# EAGLE design 1.2 (EAGLE 7.7.0)
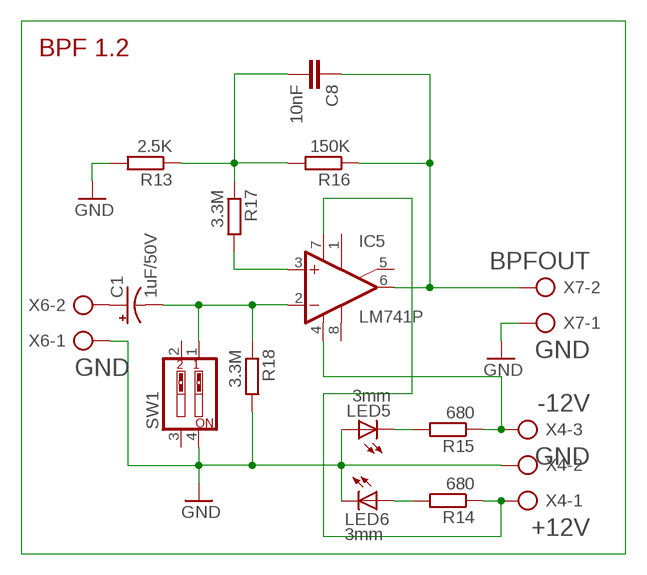
[diagram p0: schematic, sheet 1]

## Parts
C1  1uF/50V  CPOL-USE2,5-6E  [E2,5-6E]
C8  10nF  C-EU050-025X075  [C050-025X075]
IC5  LM741P  [DIL08]
LED5  3mm  LED5MM  [LED5MM]
LED6  3mm  LED5MM  [LED5MM]
R13  2.5K  R-EU_0207/10  [0207/10]
R14  680  R-EU_0207/10  [0207/10]
R15  680  R-EU_0207/10  [0207/10]
R16  150K  R-EU_0207/10  [0207/10]
R17  3.3M  R-EU_0207/10  [0207/10]
R18  3.3M  R-EU_0207/10  [0207/10]
SW1  SW_DIP-2  [EDG-02]
X4  AK500/3-H  [AK500/3-H]
X6  AK500/2-H  [AK500/2-H]
X7  AK500/2-H  [AK500/2-H]

## Nets
+12V: IC5.7(V+) R14.1 X4.1
-12V: IC5.4(V-) R15.1 X4.3
BPFOUT: C8.1 IC5.6(OUT) R16.1 X7.2
GND: LED5.A LED6.K(C) R13.2 R18.2 SW1.4 X4.2 X6.1 X7.1
N$1: C1.+ X6.2
N$9: IC5.3(+IN) R17.2
N$10: C8.2 R13.1 R16.2 R17.1
N$16: C1.- IC5.2(-IN) R18.1 SW1.1
N$23: LED5.K(C) R15.2
N$25: LED6.A R14.2
Unconnected: IC5.1(ON1) IC5.5(ON2) IC5.8(OPT) SW1.2 SW1.3

## Notes on the sheet
- BPF 1.2

## Library data of the parts
C1 = rcl:CPOL-US: POLARIZED CAPACITOR, American symbol
C8 = rcl:C-EU: CAPACITOR, European symbol
IC5 = linear:*741: OP AMP
LED5 LED6 = led:LED: LED OSRAM: - CHIPLED LG R971, LG N971, LY N971, LG Q971, LY Q971, LO R971, LY R971 LH N974, LH R974 LS Q976, LO Q976, LY Q976 LO Q996 - Hyper CHIPLED LW Q18S LB Q993, LB Q99A, LB R99A - SideLED LS A670, LO A670, LY A670, LG A670, LP A670 LB A673, LV A673, LT A673, LW A673 LH A674 LY A675 LS A676, LA A676, LO A676, LY A676, LW A676 LS A679, LY A679, LG A679 - Hyper Micro SIDELED® LS Y876, LA Y876, LO Y876, LY Y876 LT Y87S - SmartLED LW L88C, LW L88S LB L89C, LB L89S, LG L890 LS L89K, LO L89K, LY L89K LS L896, LA L896, LO L896, LY L896 - TOPLED LS T670, LO T670, LY T670, LG T670, LP T670 LSG T670, LSP T670, LSY T670, LOP T670, LYG T670 LG T671, LOG T671, LSG T671 LB T673, LV T673, LT T673, LW T673 LH T674 LS T676, LA T676, LO T676, LY T676, LB T676, LH T676, LSB T676, LW T676 LB T67C, LV T67C, LT T67C, LS T67K, LO T67K, LY T67K, LW E67C LS E67B, LA E67B, LO E67B, LY E67B, LB E67C, LV E67C, LT E67C LW T67C LS T679, LY T679, LG T679 LS T770, LO T770, LY T770, LG T770, LP T770 LB T773, LV T773, LT T773, LW T773 LH T774 LS E675, LA E675, LY E675, LS T675 LS T776, LA T776, LO T776, LY T776, LB T776 LHGB T686 LT T68C, LB T68C - Hyper Mini TOPLED® LB M676 - Mini TOPLED Santana® LG M470 LS M47K, LO M47K, LY M47K Source: http://www.osram.convergy.de LUXEON: - LUMILED® LXK2-PW12-R00, LXK2-PW12-S00, LXK2-PW14-U00, LXK2-PW14-V00 LXK2-PM12-R00, LXK2-PM12-S00, LXK2-PM14-U00 LXK2-PE12-Q00, LXK2-PE12-R00, LXK2-PE12-S00, LXK2-PE14-T00, LXK2-PE14-U00 LXK2-PB12-K00, LXK2-PB12-L00, LXK2-PB12-M00, LXK2-PB14-N00, LXK2-PB14-P00, LXK2-PB14-Q00 LXK2-PR12-L00, LXK2-PR12-M00, LXK2-PR14-Q00, LXK2-PR14-R00 LXK2-PD12-Q00, LXK2-PD12-R00, LXK2-PD12-S00 LXK2-PH12-R00, LXK2-PH12-S00 LXK2-PL12-P00, LXK2-PL12-Q00, LXK2-PL12-R00 Source: www.luxeon.com KINGBRIGHT: KA-3528ASYC Source: www.kingbright.com
R13-R18 = resistor:R-EU_: RESISTOR, European symbol
SW1 = special:SW_DIP-2: DIP SWITCH
X4 = con-ptr500:AK500/3-H: CONNECTOR Aug. 2004 / PTR Meßtechnik: Die Bezeichnung der Serie AK505 wurde geändert. Es handelt sich hierbei um AK500 in horizontaler Ausführung.; OC_FARNELL: unknown; OC_NEWARK: unknown
X6 X7 = con-ptr500:AK500/2-H: CONNECTOR Aug. 2004 / PTR Meßtechnik: Die Bezeichnung der Serie AK505 wurde geändert. Es handelt sich hierbei um AK500 in horizontaler Ausführung.; OC_FARNELL: unknown; OC_NEWARK: unknown

## Board
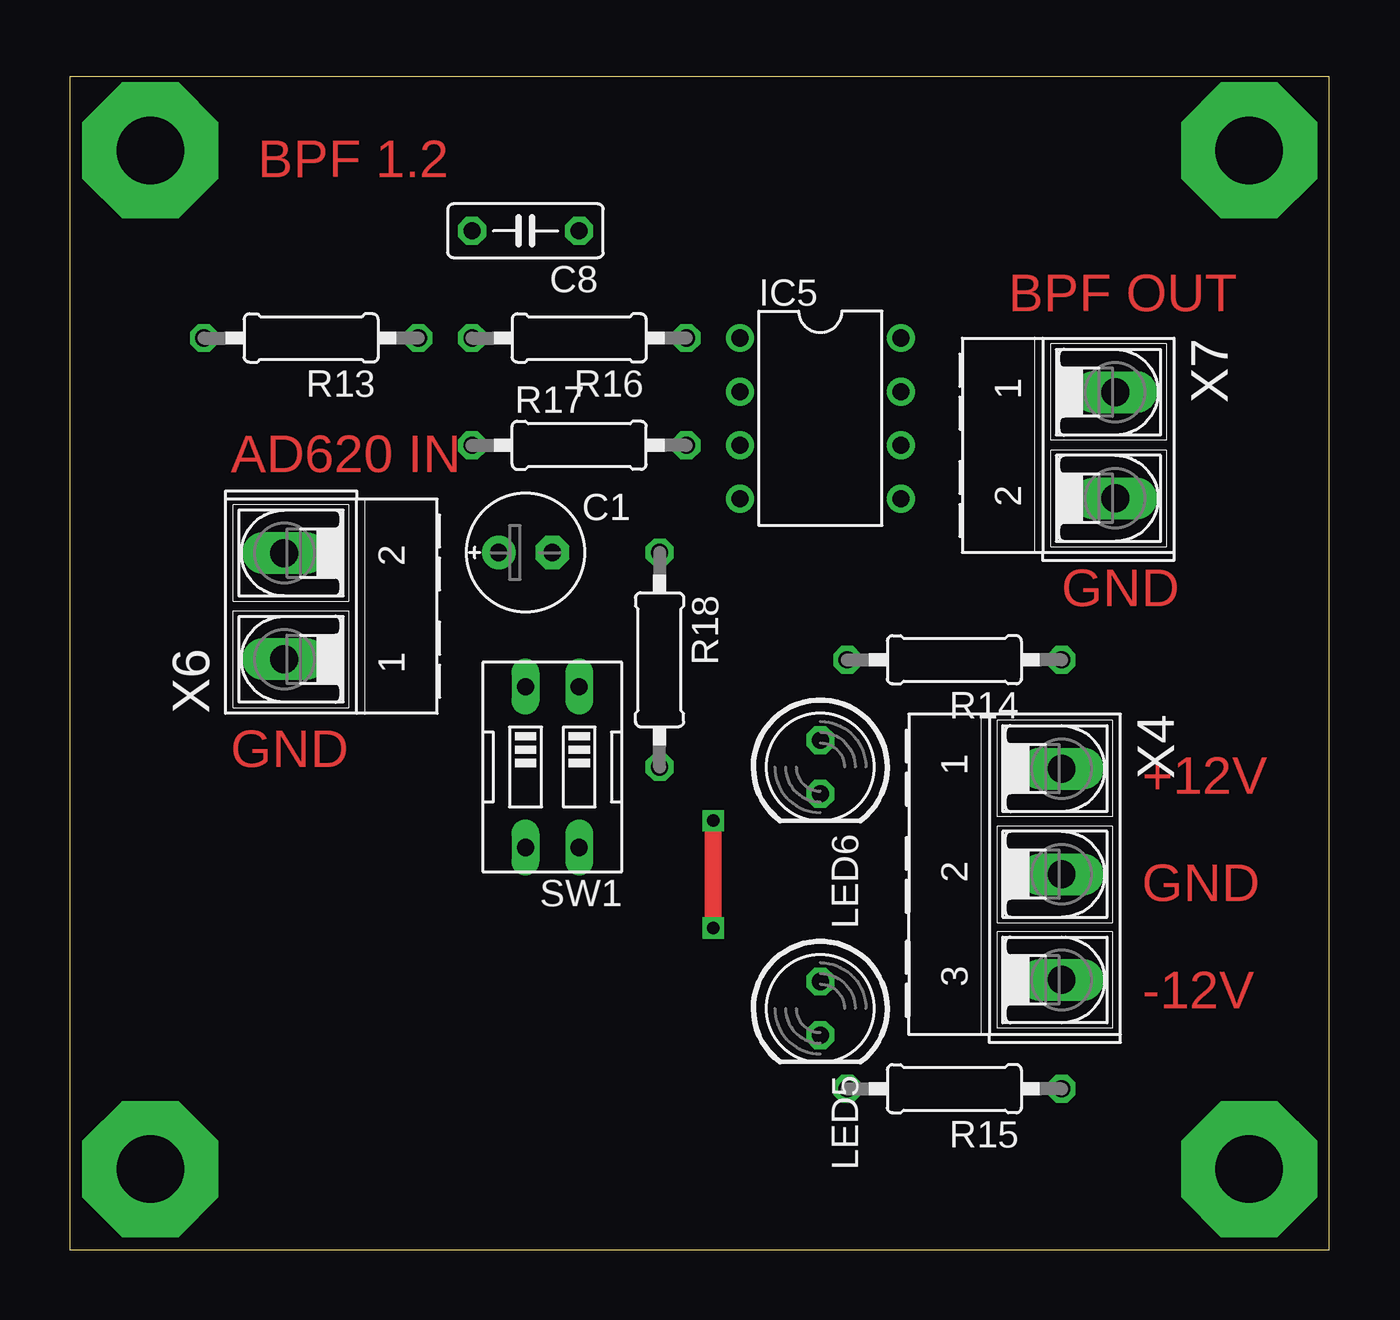
[diagram p1: board, top side]
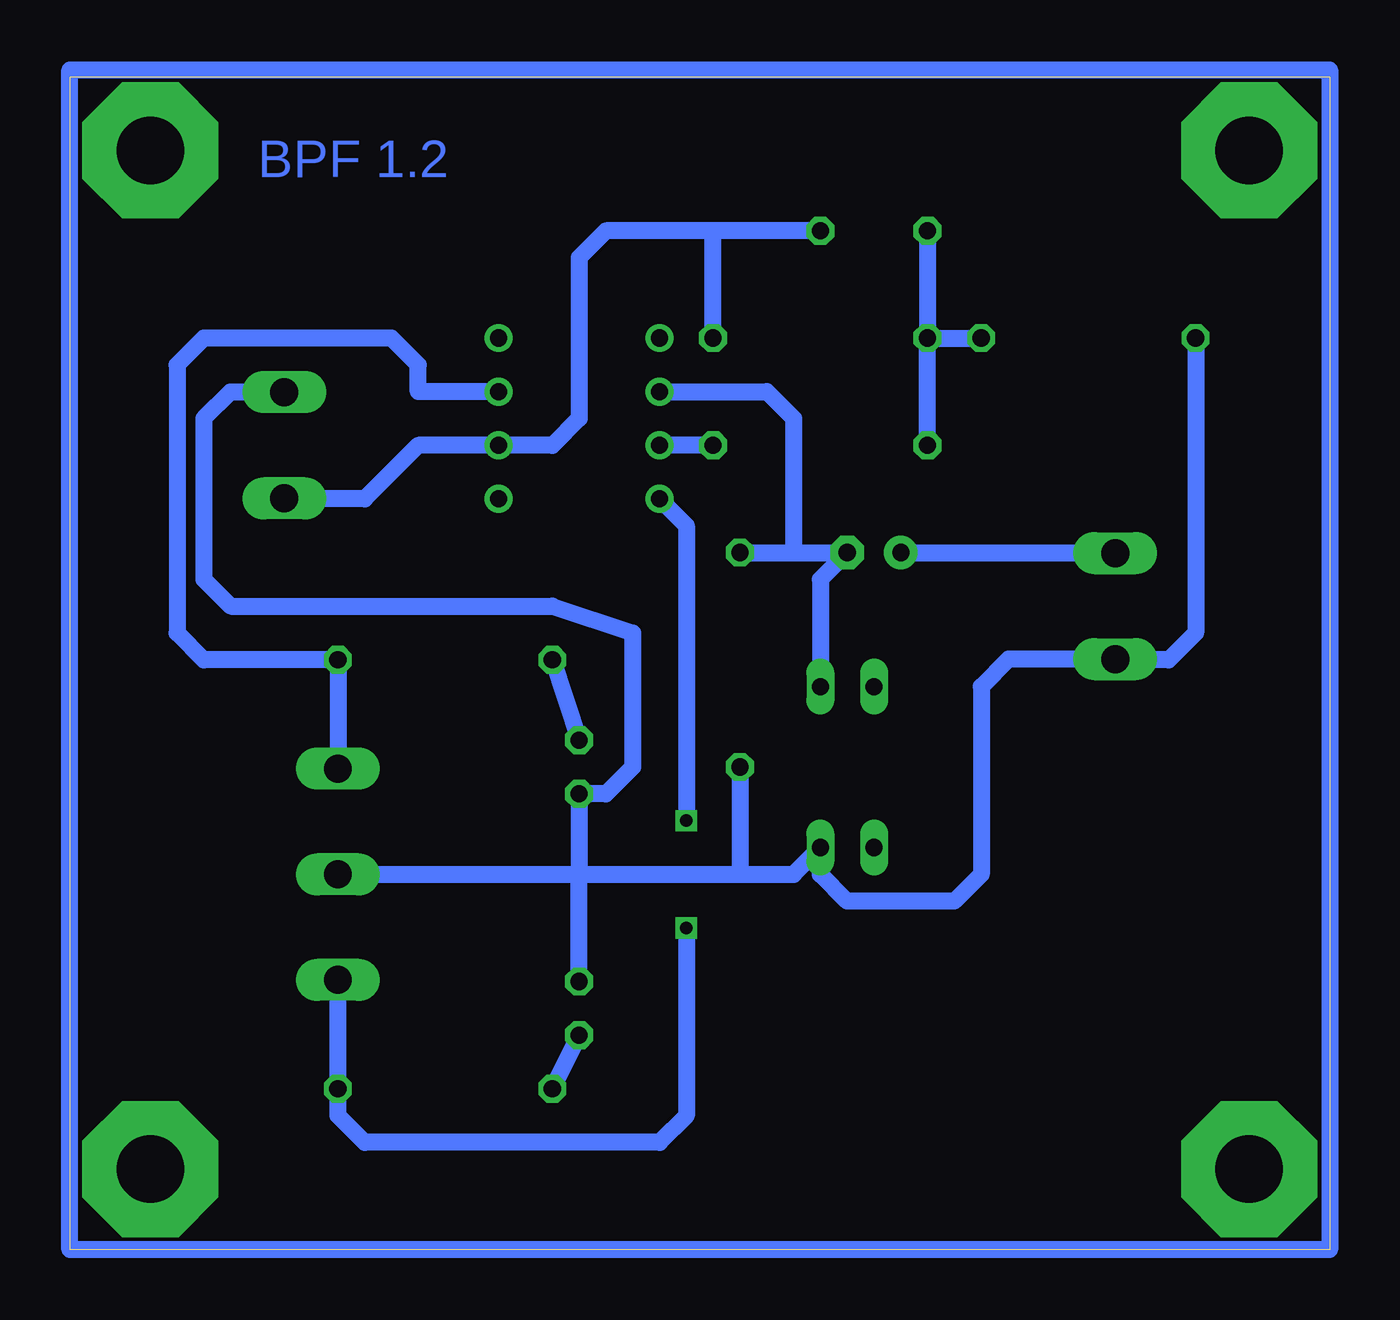
[diagram p2: board, bottom side, seen from below]

Size 59.67 x 55.55 mm. Coordinates in mm from the lower left corner, seen from the top.
Outline: 0,0 59.67,0 59.67,55.55 0,55.55 0,0
Copper layers (1*16): Top 0.035mm / dielectric 1.5mm / Bottom 0.035mm
Design rules "default": minimum track width 10mil, minimum drill 24mil, track to track 8mil, track to pad 8mil, pad to pad 8mil, via to via 8mil, smd to smd 8mil, copper to edge 40mil, drill to drill 8mil, minimum pad ring 10mil, minimum via ring 8mil, stop-mask expansion 4mil, vias tented up to drill 0mil, thermal gap 10mil

### Footprints (pad centres in the part's own frame; a part is rotated, then mirrored left to right if it is on the bottom)
E2,5-6E = drill 0.813 pad 1.575: + -1.27,0 | drill 0.813 pad 1.575 octagon: - 1.27,0
C050-025X075 = drill 0.813 octagon: 1 -2.54,0; 2 2.54,0
DIL08 = drill 0.813 pad 1.27: 1 -3.81,-3.81; 2 -1.27,-3.81; 3 1.27,-3.81; 4 3.81,-3.81; 5 3.81,3.81; 6 1.27,3.81; 7 -1.27,3.81; 8 -3.81,3.81
LED5MM = drill 0.813 octagon: A -1.27,0; K 1.27,0
0207/10 = drill 0.813 octagon: 1 -5.08,0; 2 5.08,0
EDG-02 = drill 0.813 long: 1 -1.27,-3.81; 2 1.27,-3.81; 3 1.27,3.81; 4 -1.27,3.81
AK500/3-H = drill 1.321 long: 1 -5.004,0; 2 0,0; 3 5.004,0
AK500/2-H = drill 1.321 long: 1 -2.515,0; 2 2.515,0

### Placement (x,y rotation side)
C1  21.59,33.02 0 top
C8  21.59,48.26 180 top
IC5  35.56,39.37 270 top
LED5  35.56,11.43 270 top
LED6  35.56,22.86 270 top
R13  11.43,43.18 180 top
R14  41.91,27.94 180 top
R15  41.91,7.62 180 top
R16  24.13,43.18 180 top
R17  24.13,38.1 0 top
R18  27.94,27.94 270 top
SW1  22.86,22.86 180 top
X4  46.99,17.78 270 top
X6  10.16,30.48 90 top
X7  49.53,38.1 270 top

### Tracks (layer width: path | path; a pad name or v marks a point on that pad's centre or on a via)
+12V
  Bottom 0.813: X4.1 R14.1 53.34,27.94 54.61,29.21 54.61,41.91 53.34,43.18 44.45,43.18 43.18,41.91 43.18,40.64 IC5.7
-12V  (via drill 0.6 pad 0.81)
  Top 0.813: v30.48,20.32 v30.48,15.24
  Bottom 0.813: X4.3 R15.1 46.99,6.35 45.72,5.08 31.75,5.08 30.48,6.35 v30.48,15.24 | IC5.4 30.48,34.29 v30.48,20.32
BPFOUT
  Bottom 0.813: C8.1 29.21,48.26 | 29.21,48.26 34.29,48.26 35.56,46.99 35.56,39.37 36.83,38.1 IC5.6 43.18,38.1 45.72,35.56 49.51,35.56 X7.2 | R16.1 29.21,48.26
GND
  Bottom 0.813: X4.2 35.56,17.78 | 35.56,17.78 27.94,17.78 | 27.94,17.78 25.4,17.78 SW1.4 24.13,17.78 22.86,16.51 17.78,16.51 16.51,17.78 16.51,26.67 15.21,27.96 X6.1 10.13,27.94 7.62,27.94 6.35,29.21 R13.2 | R18.2 27.94,17.78 | LED5.A 35.56,17.78 | 35.56,17.78 LED6.K 34.29,21.59 33.02,22.86 33.02,29.21 36.83,30.48 52.07,30.48 53.34,31.75 53.34,39.37 52.09,40.61 X7.1
N$1
  Bottom 0.813: X6.2 20.32,33 C1.+
N$2
  Bottom 0.813: 0,55.88 0,0 59.69,0 59.69,55.88 0,55.88
N$3  (via drill 3.2 pad 6.45)
  other vias: 55.88,3.81
N$4  (via drill 3.2 pad 6.45)
  other vias: 3.81,3.81 3.81,52.07
N$5  (via drill 3.2 pad 6.45)
  other vias: 55.88,52.07
N$9
  Bottom 0.813: R17.2 IC5.3
N$10
  Bottom 0.813: R17.1 R16.2 | R16.2 R13.1 | C8.2 R16.2
N$16
  Bottom 0.813: SW1.1 24.13,31.75 C1.- 25.4,33.02 | R18.1 25.4,33.02 | IC5.2 26.67,40.64 25.4,39.37 25.4,33.02
N$23
  Bottom 0.813: R15.2 LED5.K
N$25
  Bottom 0.813: R14.2 LED6.A

### Text on the board
Top: BPF 1.2 | BPF OUT | AD620 IN | GND | GND | +12V | GND | -12V
Bottom: BPF 1.2